# Altium schematic sheet 传感器.SchDoc
size A4
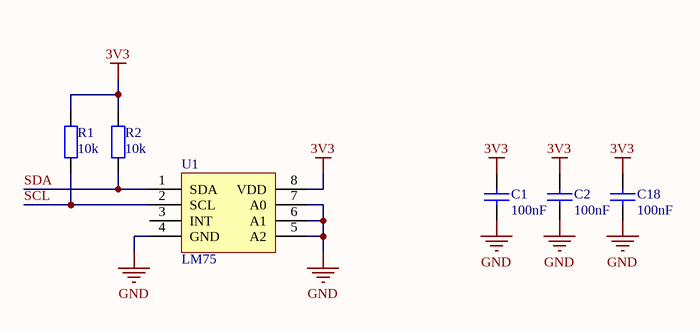
[diagram p0: 传感器.SchDoc]

## Parts
C1  100nF  [0805]
C2  100nF  [0805]
C18  100nF  [0805]
R1  10k  [0805]
R2  10k  [0805]
U1  LM75  [SO8_N]

## Nets
3V3: C1.2 C2.2 C18.2 R1.1 R2.1 U1.8(VDD)
GND: C1.1 C2.1 C18.1 U1.4(GND) U1.5(A2) U1.6(A1) U1.7(A0)
SCL: R1.2 U1.2(SCL)
SDA: R2.2 U1.1(SDA)

Not connected (* = marked no-connect by the designer): U1 3(INT)

## Library data of the parts
C1 C2 C18 = Cap: Capacitor; Value: 100pF; Published: 8-Jun-2000; LatestRevisionDate: 17-Jul-2002; LatestRevisionNote: Re-released for DXP Platform.; PackageReference: RAD-0.3; Publisher: Altium Limited; PackageDescription: Radial Cap, Thru-Hole; 2 Leads; 0.3 in Pin Spacing
R1 R2 = Res2: Resistor; Value: 1K; Published: 8-Jun-2000; LatestRevisionDate: 17-Jul-2002; LatestRevisionNote: Re-released for DXP Platform.; PackageReference: AXIAL-0.4; Publisher: Altium Limited; PackageDescription: Axial Device, Thru-Hole; 2 Leads; 0.4 in Pin Spacing